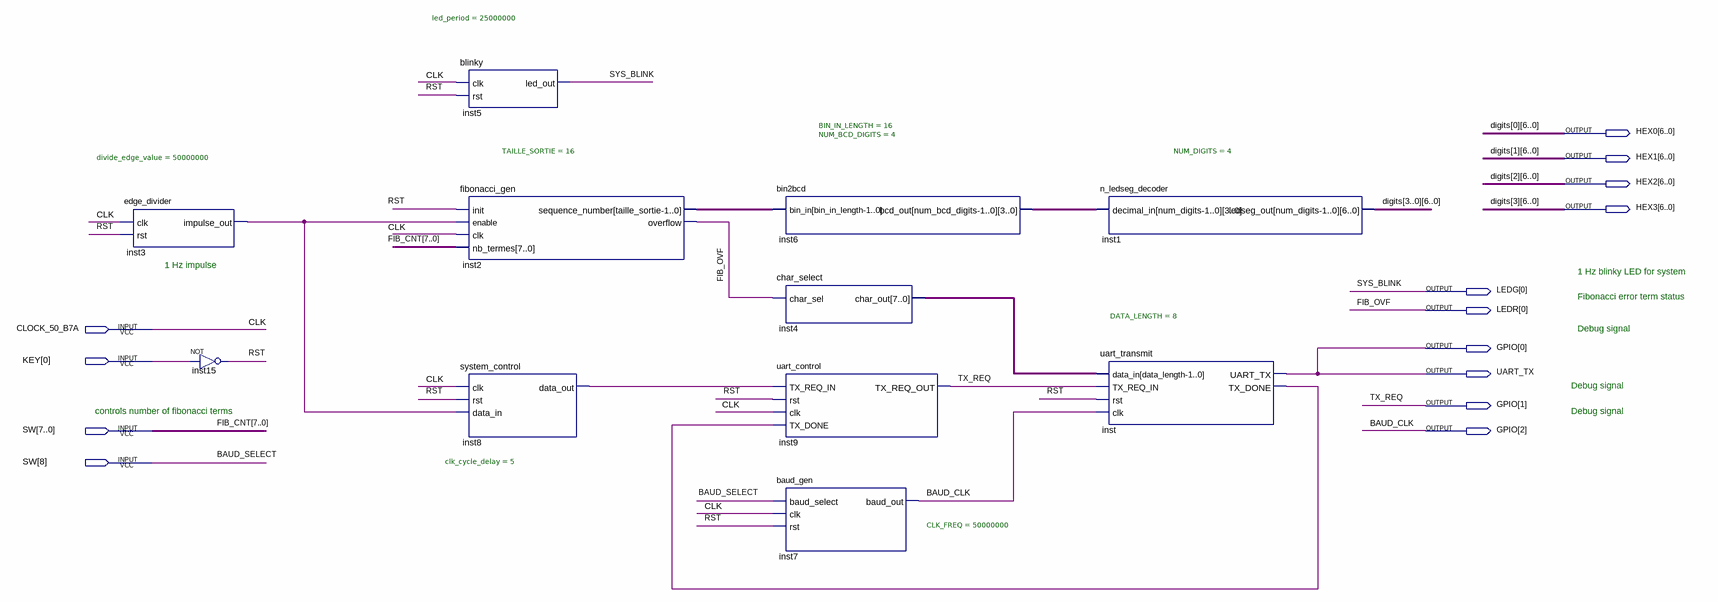
[diagram p0: schematic sheet]
// Quartus schematic system.bdf as structural Verilog: 11 symbols, 14 pins
module system (
  input  CLOCK_50_B7A,
  input  [0:0] KEY,
  input  [8:0] SW,
  output [6:0] HEX0,
  output [6:0] HEX1,
  output [6:0] HEX2,
  output [6:0] HEX3,
  output [0:0] LEDG,
  output [0:0] LEDR,
  output [2:0] GPIO,
  output UART_TX
);

  wire inst3_impulse_out, inst8_data_out, inst_tx_done, RST;
  wire [7:0] inst4_char_out;
  wire [15:0] inst2_sequence_number, inst6_bcd_out;

  edge_divider #(.divide_edge_value(50000000)) inst3 (.clk(CLOCK_50_B7A), .rst(RST), .impulse_out(inst3_impulse_out));
  not inst15 (RST, KEY[0]);
  blinky #(.led_period(25000000)) inst5 (.clk(CLOCK_50_B7A), .rst(RST), .led_out(LEDG[0]));
  fibonacci_gen #(.TAILLE_SORTIE(16)) inst2 (
    .init(RST), .enable(inst3_impulse_out), .clk(CLOCK_50_B7A), .nb_termes(SW[7:0]),
    .sequence_number(inst2_sequence_number), .overflow(LEDR[0]));
  system_control #(.clk_cycle_delay(5)) inst8 (
    .clk(CLOCK_50_B7A), .rst(RST), .data_in(inst3_impulse_out), .data_out(inst8_data_out));
  bin2bcd #(.BIN_IN_LENGTH(16), .NUM_BCD_DIGITS(4)) inst6 (.bin_in(inst2_sequence_number), .bcd_out(inst6_bcd_out));
  char_select inst4 (.char_sel(LEDR[0]), .char_out(inst4_char_out));
  uart_control inst9 (
    .TX_REQ_IN(inst8_data_out), .rst(RST), .clk(CLOCK_50_B7A), .TX_DONE(inst_tx_done), .TX_REQ_OUT(GPIO[1]));
  baud_gen #(.CLK_FREQ(50000000)) inst7 (.baud_select(SW[8]), .clk(CLOCK_50_B7A), .rst(RST), .baud_out(GPIO[2]));
  n_ledseg_decoder #(.NUM_DIGITS(4)) inst1 (.decimal_in(inst6_bcd_out), .ledseg_out({HEX3, HEX2, HEX1, HEX0}));
  uart_transmit #(.DATA_LENGTH(8)) inst (
    .data_in(inst4_char_out), .TX_REQ_IN(GPIO[1]), .rst(RST), .clk(GPIO[2]), .UART_TX(GPIO[0]),
    .TX_DONE(inst_tx_done));

  assign UART_TX = GPIO[0];

  // Other names for the same wires on the sheet: BAUD_CLK = GPIO[2]; BAUD_SELECT = SW[8]; CLK = CLOCK_50_B7A;
  //   digits_0[6:0] = HEX0; digits_1[6:0] = HEX1; digits_2[6:0] = HEX2; digits_3[6:0] = HEX3; FIB_CNT[7:0] = SW[7:0];
  //   FIB_OVF = LEDR[0]; SYS_BLINK = LEDG[0]; TX_REQ = GPIO[1]

  // Notes on the sheet:
  //   1 Hz impulse
  //   1 Hz blinky LED for system
  //   Fibonacci error term status
  //   Debug signal
  //   Debug signal
  //   controls number of fibonacci terms
  //   Debug signal
endmodule
